# Altium schematic sheet Arduino_Shield.SchDoc: Arduino Shield_1
size A4; Organization: University of Colorado; Address1: Boulder; DocumentNumber: 1; Revision: 0; SheetNumber: 1; SheetTotal: 2
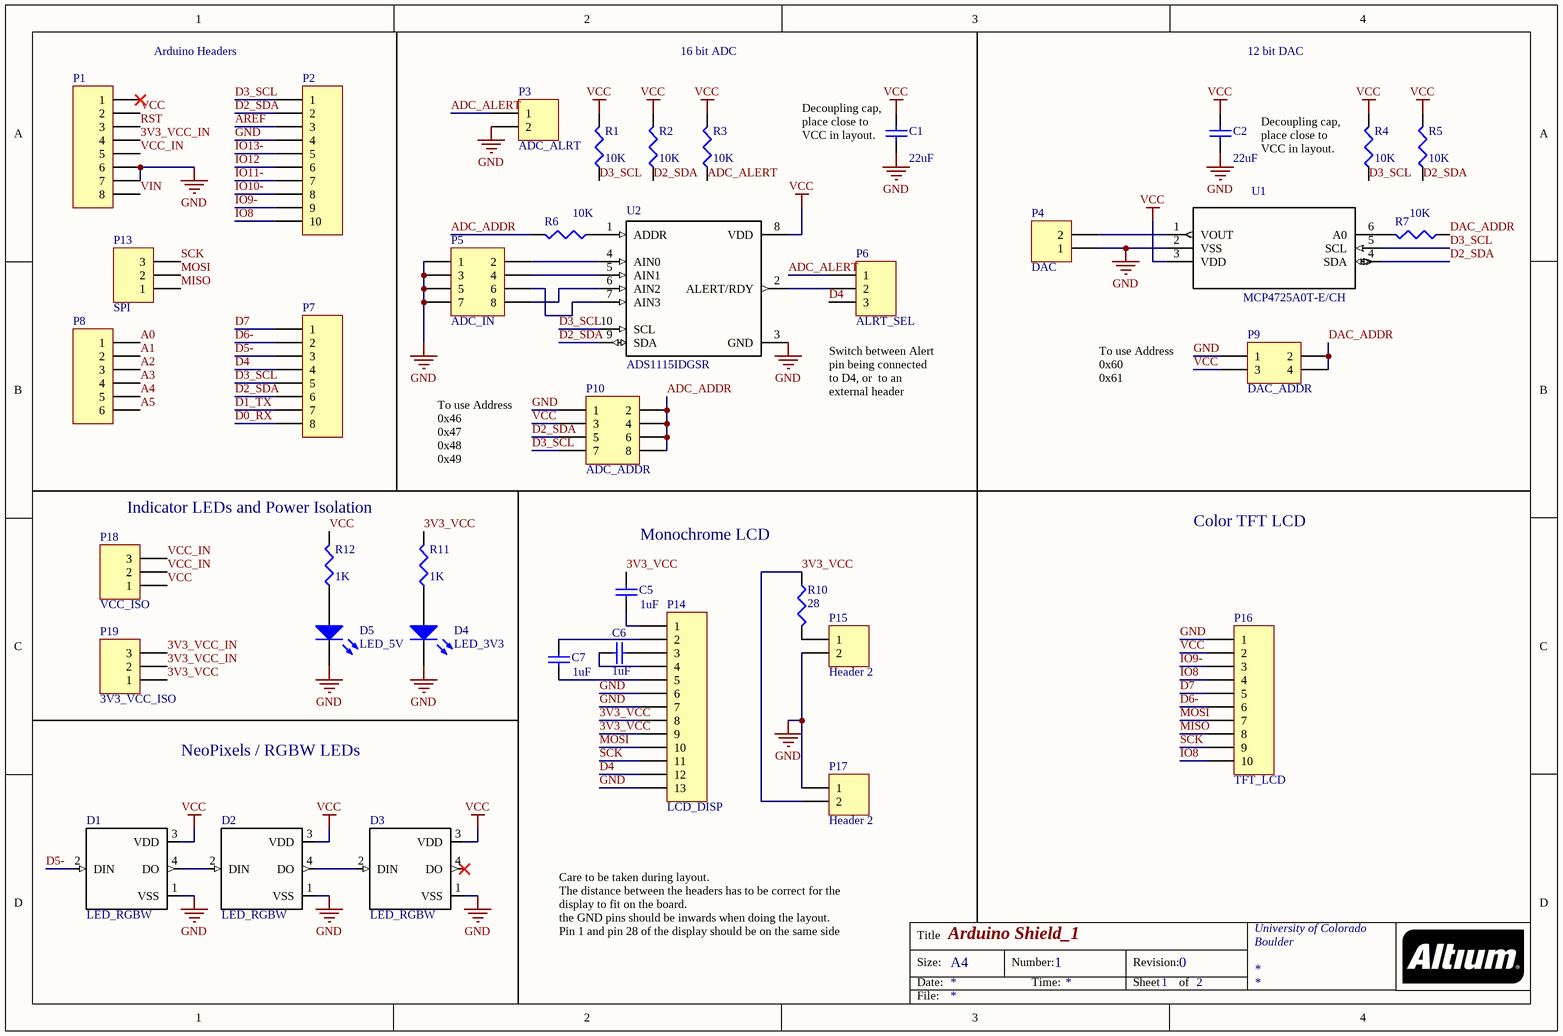
[diagram p0: Arduino_Shield.SchDoc]

## Parts
C1  value 22uF  [C1206]  (hidden comment: Cap Semi)
C2  value 22uF  [C1206]  (hidden comment: Cap Semi)
C5  value 1uF  [C1206]  (hidden comment: Cap Semi)
C6  value 1uF  [C1206]  (hidden comment: Cap Semi)
C7  value 1uF  [C1206]  (hidden comment: Cap Semi)
D1  LED_RGBW  [*LED_IN-PI554FCH]
D2  LED_RGBW  [*LED_IN-PI554FCH]
D3  LED_RGBW  [*LED_IN-PI554FCH]
D4  LED_3V3  [3.2X1.6X1.1]
D5  LED_5V  [3.2X1.6X1.1]
P1  P4  [HDR1X8]  (value not drawn)
P2  P1  [HDR1X10]  (value not drawn)
P3  ADC_ALRT  [HDR1X2]
P4  DAC  [HDR1X2]
P5  ADC_IN  [HDR2X4]
P6  ALRT_SEL  [HDR1X3]
P7  P2  [HDR1X8]  (value not drawn)
P8  P3  [HDR1X6]  (value not drawn)
P9  DAC_ADDR  [HDR2X2]
P10  ADC_ADDR  [HDR2X4]
P13  SPI  [HDR1X3]
P14  LCD_DISP  [HDR1X13]
P15  Header 2  [HDR1X2]
P16  TFT_LCD  [HDR1X10]
P17  Header 2  [HDR1X2]
P18  VCC_ISO  [HDR1X3]
P19  3V3_VCC_ISO  [HDR1X3]
R1  value 10K  [C1206]  (hidden comment: Res3)
R2  value 10K  [C1206]  (hidden comment: Res3)
R3  value 10K  [C1206]  (hidden comment: Res3)
R4  value 10K  [C1206]  (hidden comment: Res3)
R5  value 10K  [C1206]  (hidden comment: Res3)
R6  value 10K  [C1206]  (hidden comment: Res3)
R7  value 10K  [C1206]  (hidden comment: Res3)
R10  value 28  [C1206]  (hidden comment: Res3)
R11  value 1K  [C1206]  (hidden comment: Res3)
R12  value 1K  [C1206]  (hidden comment: Res3)
U1  MCP4725A0T-E/CH  [*SOT95P270X145-6N]
U2  ADS1115IDGSR  [*SOP50P490X110-10N]

## Nets
GND: C1.1 C2.1 D1.1(VSS) D2.1(VSS) D3.1(VSS) D4.2(K) D5.2(K) P1.6 P1.7 P2.4 P3.2 P4.1 P5.1 P5.3 P5.5 P5.7 P9.1 P10.1 P14.6 P14.7 P14.13 P15.2 P16.1 P17.1 U1.2(VSS) U2.3(GND)
VCC: C1.2 C2.2 D1.3(VDD) D2.3(VDD) D3.3(VDD) P1.2 P9.3 P10.3 P16.2 P18.1 R1.2 R2.2 R3.2 R4.2 R5.2 R12.2 U1.3(VDD) U2.8(VDD)
3V3_VCC: C5.2 P14.8 P14.9 P17.2 P19.1 R10.1 R11.2
3V3_VCC_IN: P1.4 P19.2 P19.3
A0: P8.1
A1: P8.2
A2: P8.3
A3: P8.4
A4: P8.5
A5: P8.6
ADC_ADDR: P10.2 P10.4 P10.6 P10.8 R6.2
ADC_ALERT: P3.1 P6.1 R3.1
AREF: P2.3
D0_RX: P7.8
D1_TX: P7.7
D2_SDA: P2.2 P7.6 P10.5 R2.1 R5.1 U1.4(SDA) U2.9(SDA)
D3_SCL: P2.1 P7.5 P10.7 R1.1 R4.1 U1.5(SCL) U2.10(SCL)
D4: P6.3 P7.4 P14.12
D5-: D1.2(DIN) P7.3
D6-: P7.2 P16.6
D7: P7.1 P16.5
DAC_ADDR: P9.2 P9.4 R7.1
IO8: P2.10 P16.4 P16.10
IO9-: P2.9 P16.3
IO10-: P2.8
IO11-: P2.7
IO12: P2.6
IO13-: P2.5
MISO: P13.1 P16.8
MOSI: P13.2 P14.10 P16.7
RST: P1.3
SCK: P13.3 P14.11 P16.9
VCC_IN: P1.5 P18.2 P18.3
VIN: P1.8
NetC5_1: C5.1 P14.1
NetC6_1: C6.1 P14.3
NetC6_2: C6.2 P14.4
NetC7_1: C7.1 P14.5
NetC7_2: C7.2 P14.2
NetD1_4: D1.4(DO) D2.2(DIN)
NetD2_4: D2.4(DO) D3.2(DIN)
NetD4_1: D4.1(A) R11.1
NetD5_1: D5.1(A) R12.1
NetP4_2: P4.2 U1.1(VOUT)
NetP5_2: P5.2 U2.4(AIN0)
NetP5_4: P5.4 U2.5(AIN1)
NetP5_6: P5.6 U2.7(AIN3)
NetP5_8: P5.8 U2.6(AIN2)
NetP6_2: P6.2 U2.2(ALERT/RDY)
NetP15_1: P15.1 R10.2
NetR6_1: R6.1 U2.1(ADDR)
NetR7_2: R7.2 U1.6(A0)

Not connected (* = marked no-connect by the designer): D3 4(DO)*; P1 1*

## Notes on the sheet
- Arduino Headers
- 16 bit ADC
- 12 bit DAC
- (near C1) Decoupling cap, place close to VCC in layout.
- Decoupling cap, place close to VCC in layout.
- To use Address
  0x60
  0x61
- (near P6) Switch between Alert pin being connected to D4, or  to an external header
- Indicator LEDs and Power Isolation
- To use Address
  0x46
  0x47
  0x48
  0x49
- Monochrome LCD
- Color TFT LCD
- NeoPixels / RGBW LEDs
- Care to be taken during layout.
  The distance between the headers has to be correct for the display to fit on the board.
  the GND pins should be inwards when doing the layout.
  Pin 1 and pin 28 of the display should be on the same side
- Title
- Size:
- Date:
- A4
- Number:
- Time:
- Revision:
- Sheet
- of
- File:

## Library data of the parts
C1 C2 C5-C7 = Cap Semi: Capacitor (Semiconductor SIM Model); Published: 8-Jun-2000; LatestRevisionDate: 29-May-2009; LatestRevisionNote: IPC-7351 Footprint Added.; PackageReference: C1206; Publisher: Altium Limited; PackageDescription: Chip Capacitor
  C1 C2: DigiKeyPartNo: 1276-1079-1-ND
  C5-C7: DigiKeyPartNo: 732-7692-1-ND
D1-D3 = IN-PI554FCH: 5050RGB with integrated IC built in 4 PIN Â•Viewing angle: 120 degrees; MF: Inolux; Availability: Unavailable; Price: None; MP: IN-PI554FCH; Package: SMD-4 Innolux; SnapEDA_Link: https://www.snapeda.com/parts/IN-PI554FCH/Inolux/view-part/?ref=snap; Value: *; DigiKeyPartNo: 1830-1209-1-ND
D4 D5 = LED2: Typical RED, GREEN, YELLOW, AMBER GaAs LED; Published: 8-Jun-2000; LatestRevisionDate: 17-Jul-2002; LatestRevisionNote: Re-released for DXP Platform.; PackageVersion: Feb-2002; PackageReference: 3.2X1.6X1.1; Publisher: Altium Limited; PackageDescription: SM LED; 2 Flat Leads
P1 P7 = Header 8: Header, 8-Pin; LatestRevisionDate: 17-Jul-2002; LatestRevisionNote: Re-released for DXP Platform.; Publisher: Altium Limited; DigiKeyPartNo: 1568-1413-ND
P2 P16 = Header 10: Header, 10-Pin; LatestRevisionDate: 17-Jul-2002; LatestRevisionNote: Re-released for DXP Platform.; Publisher: Altium Limited
  P2: DigiKeyPartNo: 1568-1413-ND
  P16: DigiKeyPartNo: 1212-1179-ND
P3 P4 P15 P17 = Header 2: Header, 2-Pin; LatestRevisionDate: 17-Jul-2002; LatestRevisionNote: Re-released for DXP Platform.; Publisher: Altium Limited
  P3 P4: DigiKeyPartNo: 732-5315-ND
  P15 P17: DigiKeyPartNo: 1212-1179-ND
P5 P10 = Header 4X2: Header, 4-Pin, Dual row; LatestRevisionDate: 17-Jul-2002; LatestRevisionNote: Re-released for DXP Platform.; Publisher: Altium Limited; DigiKeyPartNo: 952-2121-ND
P6 P13 P18 P19 = Header 3: Header, 3-Pin; LatestRevisionDate: 17-Jul-2002; LatestRevisionNote: Re-released for DXP Platform.; Publisher: Altium Limited
  P6: DigiKeyPartNo: 732-5315-ND
  P13 P18 P19: DigiKeyPartNo: 1568-1413-ND
P8 = Header 6: Header, 6-Pin; LatestRevisionDate: 17-Jul-2002; LatestRevisionNote: Re-released for DXP Platform.; Publisher: Altium Limited; DigiKeyPartNo: 1568-1413-ND
P9 = Header 2X2: Header, 2-Pin, Dual row; LatestRevisionDate: 17-Jul-2002; LatestRevisionNote: Re-released for DXP Platform.; Publisher: Altium Limited; DigiKeyPartNo: 952-2121-ND
P14 = Header 13: Header, 13-Pin; LatestRevisionDate: 17-Jul-2002; LatestRevisionNote: Re-released for DXP Platform.; Publisher: Altium Limited; DigiKeyPartNo: 1212-1179-ND
R1-R7 R10-R12 = Res3: Resistor; Published: 8-Jun-2000; LatestRevisionDate: 29-May-2009; LatestRevisionNote: IPC-7351 Footprint Added.; PackageReference: J1-0603; Publisher: Altium Limited; PackageDescription: Chip Resistor
  R1-R7: DigiKeyPartNo: RMCF1206JT10K0CT-ND
  R10: DigiKeyPartNo: RMCF1206FT28R0
U1 = MCP4725A0T-E/CH: MCP4725 Series 1 Ch I2C EEPROM Memory 5.5 V 12-Bit D/A Converter SMT - SOT-23-6; MF: Microchip; SnapEDA_Link: https://www.snapeda.com/parts/MCP4725A0T-E/CH/Microchip/view-part/?ref=snap; MP: MCP4725A0T-E/CH; Availability: Unavailable; Price: None; Package: SOT-23-6 Microchip; Value: *; DigiKeyPartNo: MCP4725A0T-E/CHCT-ND
U2 = ADS1115IDGSR: 16-Bit ADC with Integrated MUX, PGA, Comparator, Oscillator, and Reference 10-VSSOP -40 to 125; MF: Texas Instruments; MP: ADS1115IDGSR; Price: None; SnapEDA_Link: https://www.snapeda.com/parts/ADS1115IDGSR/Texas%20Instruments/view-part/?ref=snap; Package: MSOP-10 Texas Instruments; Availability: Unavailable; Value: *; DigiKeyPartNo: 296-38849-1-ND